# EAGLE design RigidPCBSensor_2withground17 (EAGLE 9.6.2)
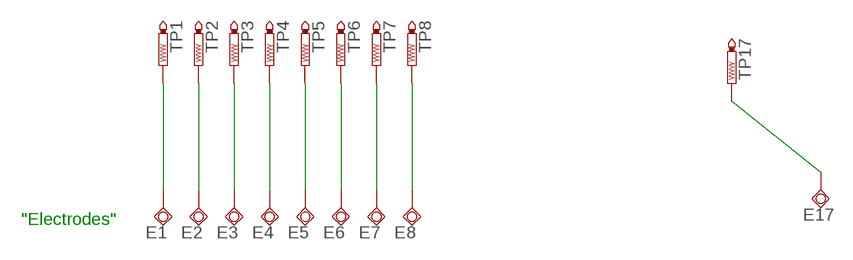
[diagram p0: schematic, sheet 1]

## Parts
E1  TPSQTP15R  [TP15R]
E2  TPSQTP15R  [TP15R]
E3  TPSQTP15R  [TP15R]
E4  TPSQTP15R  [TP15R]
E5  TPSQTP15R  [TP15R]
E6  TPSQTP15R  [TP15R]
E7  TPSQTP15R  [TP15R]
E8  TPSQTP15R  [TP15R]
E17  TPSQTP15R  [TP15R]
TP1  PTR1  [TP10SQLONG]
TP2  PTR1  [TP10SQLONG]
TP3  PTR1  [TP10SQLONG]
TP4  PTR1  [TP10SQLONG]
TP5  PTR1  [TP10SQLONG]
TP6  PTR1  [TP10SQLONG]
TP7  PTR1  [TP10SQLONG]
TP8  PTR1  [TP10SQLONG]
TP17  PTR1  [TP10SQLONG]

## Nets
N$1: E1.TP TP1.TP
N$2: E2.TP TP2.TP
N$3: E3.TP TP3.TP
N$4: E4.TP TP4.TP
N$5: E5.TP TP5.TP
N$6: E6.TP TP6.TP
N$7: E7.TP TP7.TP
N$8: E8.TP TP8.TP
N$17: E17.TP TP17.TP

## Notes on the sheet
- "Electrodes"

## Library data of the parts
E1-E8 E17 = testpad:TPSQ: Test pad
TP1-TP8 TP17 = RigidPCBSensor_1:PTR1: TEST PIN

## Board
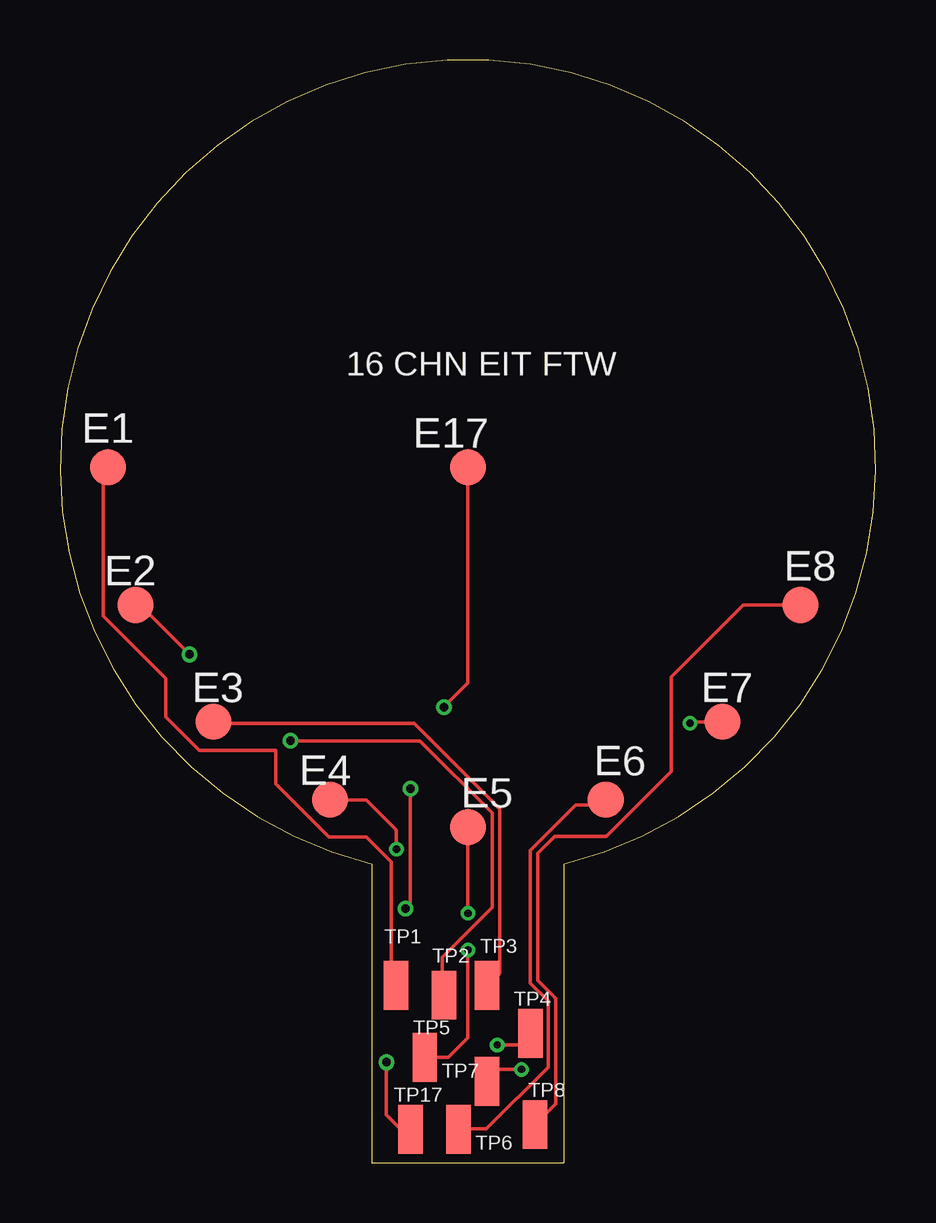
[diagram p1: board, top side]
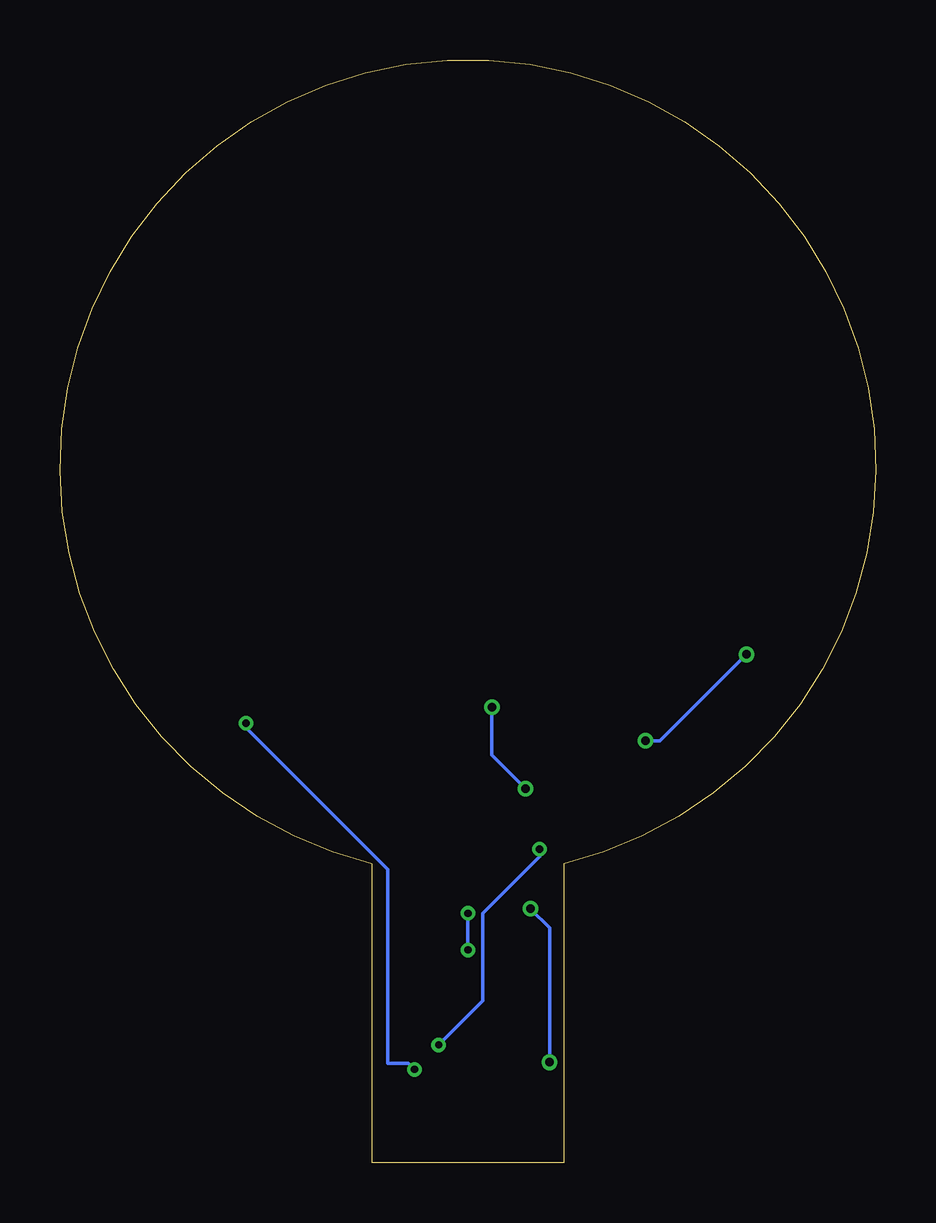
[diagram p2: board, bottom side, seen from below]

Size 34 x 45.98 mm. Coordinates in mm from the lower left corner, seen from the top.
Outline: 21,12.48 arc333 13,12.48 13,0 21,0 21,12.48
Copper layers (1*16): Top 0.035mm / dielectric 1.5mm / Bottom 0.035mm
Design rules "SparkFun-2-layer-PCBWay-LIMIT": minimum track width 6mil, minimum drill 0.3mm, track to track 6mil, track to pad 6mil, pad to pad 6mil, via to via 6mil, smd to smd 6mil, copper to edge 6mil, drill to drill 6mil, minimum pad ring 6mil, minimum via ring 6mil, stop-mask expansion 4mil, vias tented up to drill 25mil, thermal gap 10mil

### Footprints (pad centres in the part's own frame; a part is rotated, then mirrored left to right if it is on the bottom)
TP15R = smd 1.5 x 1.5: TP 0,0
TP10SQLONG = smd 1.016 x 2.032: TP 0,0

### Placement (x,y rotation side)
E1  2,29 0 top
E2  3.14,23.26 0 top
E3  6.39,18.39 0 top
E4  11.26,15.14 0 top
E5  17,14 0 top
E6  22.74,15.14 0 top
E7  27.61,18.39 0 top
E8  30.86,23.26 0 top
E17  17,29 0 top
TP1  14,7.4 0 top
TP2  16,7 0 top
TP3  17.8,7.4 0 top
TP4  19.6,5.4 0 top
TP5  15.2,4.4 0 top
TP6  16.6,1.4 0 top
TP7  17.8,3.4 0 top
TP8  19.8,1.6 0 top
TP17  14.6,1.4 0 top

### Tracks (layer width: path | path; a pad name or v marks a point on that pad's centre or on a via)
N$1
  Top 0.152: TP1.TP 13.95,7.51 13.8,7.66 13.8,12.55 12.75,13.6 11.2,13.6 9,15.8 9,17.2 5.8,17.2 4.4,18.6 4.4,20.2 1.8,22.8 1.8,28.8 E1.TP
N$2  (via drill 0.35)
  Top 0.152: TP2.TP 15.93,7.07 15.93,8.58 18.01,10.66 18.01,14.59 15,17.6 v9.6,17.6 | E2.TP 3.34,23.26 v5.4,21.2
  Bottom 0.152: v5.4,21.2 9,17.6 v9.6,17.6
N$3
  Top 0.152: TP3.TP 18.31,7.9 18.31,14.77 14.75,18.33 6.45,18.33 E3.TP
N$4  (via drill 0.3)
  Top 0.152: v18.22,4.92 19.13,4.92 19.59,5.38 TP4.TP | v14.02,13.08 14.02,13.88 12.76,15.14 E4.TP
  Bottom 0.152: v18.22,4.92 16.39,6.75 16.39,10.41 14.02,12.78 v14.02,13.08
N$5  (via drill 0.3)
  Top 0.152: v17,10.41 E5.TP | v17,8.88 17,5.23 16.17,4.4 TP5.TP
  Bottom 0.152: v17,8.88 v17,10.41
N$6
  Top 0.152: TP6.TP 16.73,1.42 17.76,1.42 20.34,3.99 20.34,6.75 19.6,7.49 19.6,13.03 21.49,14.92 22.52,14.92 E6.TP
N$7  (via drill 0.3)
  Top 0.152: 18.07,3.7 17.91,3.55 TP7.TP 18.3,3.9 v19.23,3.9 | v26.25,18.33 26.31,18.39 E7.TP
  Bottom 0.152: v19.23,3.9 19.48,4.16 20.2,4.16 20.21,4.16 20.35,4.16 20.35,12.24 26.25,18.13 v26.25,18.33
N$8
  Top 0.152: E8.TP 28.46,23.26 25.47,20.27 25.47,16.32 22.76,13.61 20.61,13.61 19.9,12.91 19.9,7.62 20.66,6.86 20.66,2.46 TP8.TP 19.8,2
N$17  (via drill 0.35)
  Top 0.152: 14.4,1.2 TP17.TP 14.2,1.4 13.6,2 v13.6,4.2 | E17.TP 17,20 v16,19 | v14.6,15.6 14.6,10.8 v14.4,10.6
  Bottom 0.152: v16,19 16,17 v14.6,15.6 | v14.4,10.6 13.6,9.8 v13.6,4.2

### Text on the board
tPlace: 16 CHN EIT FTW